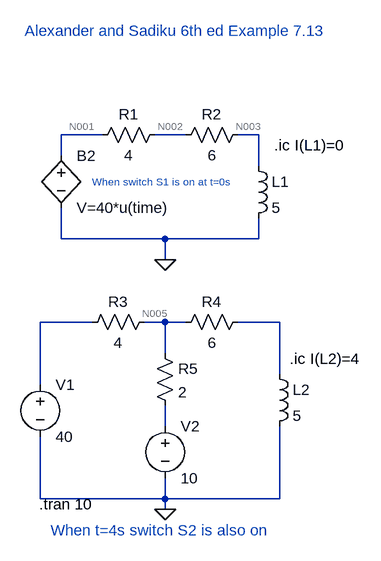
[diagram p0: schematic sadiku_chapter7_example_713_RL_with_two_switch.asc]
sadiku_chapter7_example_713_RL_with_two_switch.asc, the LTspice schematic file:
Version 4
SHEET 1 880 740
WIRE 64 112 0 112
WIRE 192 112 144 112
WIRE 304 112 272 112
WIRE 0 144 0 112
WIRE 304 160 304 112
WIRE 0 272 0 224
WIRE 160 272 0 272
WIRE 304 272 304 240
WIRE 304 272 160 272
WIRE 160 304 160 272
WIRE 48 400 -32 400
WIRE 160 400 128 400
WIRE 192 400 160 400
WIRE 336 400 272 400
WIRE 160 448 160 400
WIRE 336 480 336 400
WIRE -32 496 -32 400
WIRE 160 560 160 528
WIRE -32 672 -32 576
WIRE 160 672 160 640
WIRE 160 672 -32 672
WIRE 336 672 336 560
WIRE 336 672 160 672
WIRE 160 688 160 672
FLAG 160 304 0
FLAG 160 688 0
SYMBOL res 160 96 R90
WINDOW 0 0 56 VBottom 2
WINDOW 3 32 56 VTop 2
SYMATTR InstName R1
SYMATTR Value 4
SYMBOL res 288 96 R90
WINDOW 0 0 56 VBottom 2
WINDOW 3 32 56 VTop 2
SYMATTR InstName R2
SYMATTR Value 6
SYMBOL ind 288 144 R0
SYMATTR InstName L1
SYMATTR Value 5
SYMBOL res 144 384 R90
WINDOW 0 0 56 VBottom 2
WINDOW 3 32 56 VTop 2
SYMATTR InstName R3
SYMATTR Value 4
SYMBOL res 288 384 R90
WINDOW 0 0 56 VBottom 2
WINDOW 3 32 56 VTop 2
SYMATTR InstName R4
SYMATTR Value 6
SYMBOL ind 320 464 R0
SYMATTR InstName L2
SYMATTR Value 5
SYMBOL res 144 432 R0
SYMATTR InstName R5
SYMATTR Value 2
SYMBOL bv 0 128 R0
SYMATTR InstName B2
SYMATTR Value V=40*u(time)
SYMBOL voltage -32 480 R0
WINDOW 123 0 0 Left 0
WINDOW 39 0 0 Left 0
SYMATTR InstName V1
SYMATTR Value 40
SYMBOL voltage 160 544 R0
WINDOW 123 0 0 Left 0
WINDOW 39 0 0 Left 0
SYMATTR InstName V2
SYMATTR Value 10
TEXT 328 128 Left 2 !.ic I(L1)=0
TEXT -34 680 Left 2 !.tran 10
TEXT 352 456 Left 2 !.ic I(L2)=4
TEXT 48 184 Left 1 ;When switch S1 is on at t=0s
TEXT -16 720 Left 2 ;When t=4s switch S2 is also on
TEXT -56 -48 Left 2 ;Alexander and Sadiku 6th ed Example 7.13

The netlist it stands for:
* sadiku_chapter7_example_713_RL_with_two_switch.asc
R1 N002 N001 4
R2 N003 N002 6
L1 N003 0 5
R3 N005 N004 4
R4 N006 N005 6
L2 N006 0 5
R5 N005 N007 2
B2 N001 0 V=40*u(time)
V1 N004 0 40
V2 N007 0 10
.ic I(L1)=0
.tran 10
.ic I(L2)=4
* When switch S1 is on at t=0s
* When t=4s switch S2 is also on
* Alexander and Sadiku 6th ed Example 7.13
.backanno
.end

* Results of the author's LTspice run, read from the files saved beside the schematic
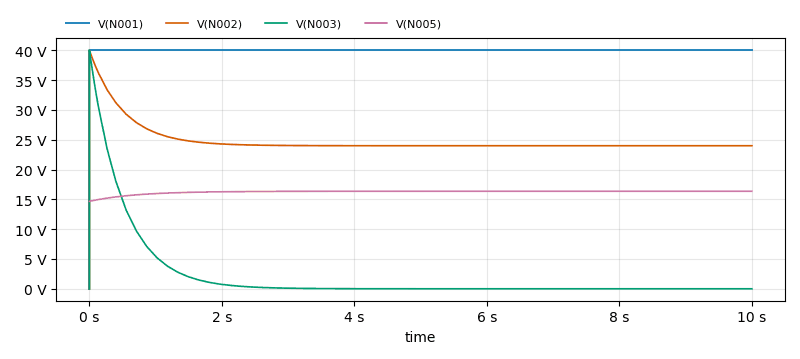
[diagram p1: Transient Analysis of sadiku_chapter7_example_713_RL_with_two_switch.asc, plotted from the saved traces]
* Transient Analysis, 1 run:
*   V(N001): min 0 V, max 40 V, average 40 V, rms 40 V, last 40 V
*   V(N002): min 0 V, max 40 V, average 24.81 V, rms 24.92 V, last 24 V
*   V(N003): min 0 V, max 40 V, average 2.015 V, rms 6.375 V, last 4 mV
*   V(N005): min 14.67 V, max 16.36 V, average 16.25 V, rms 16.25 V, last 16.36 V